# Altium schematic sheet Battery.SchDoc
size A4; SheetNumber: 2; SheetTotal: 21
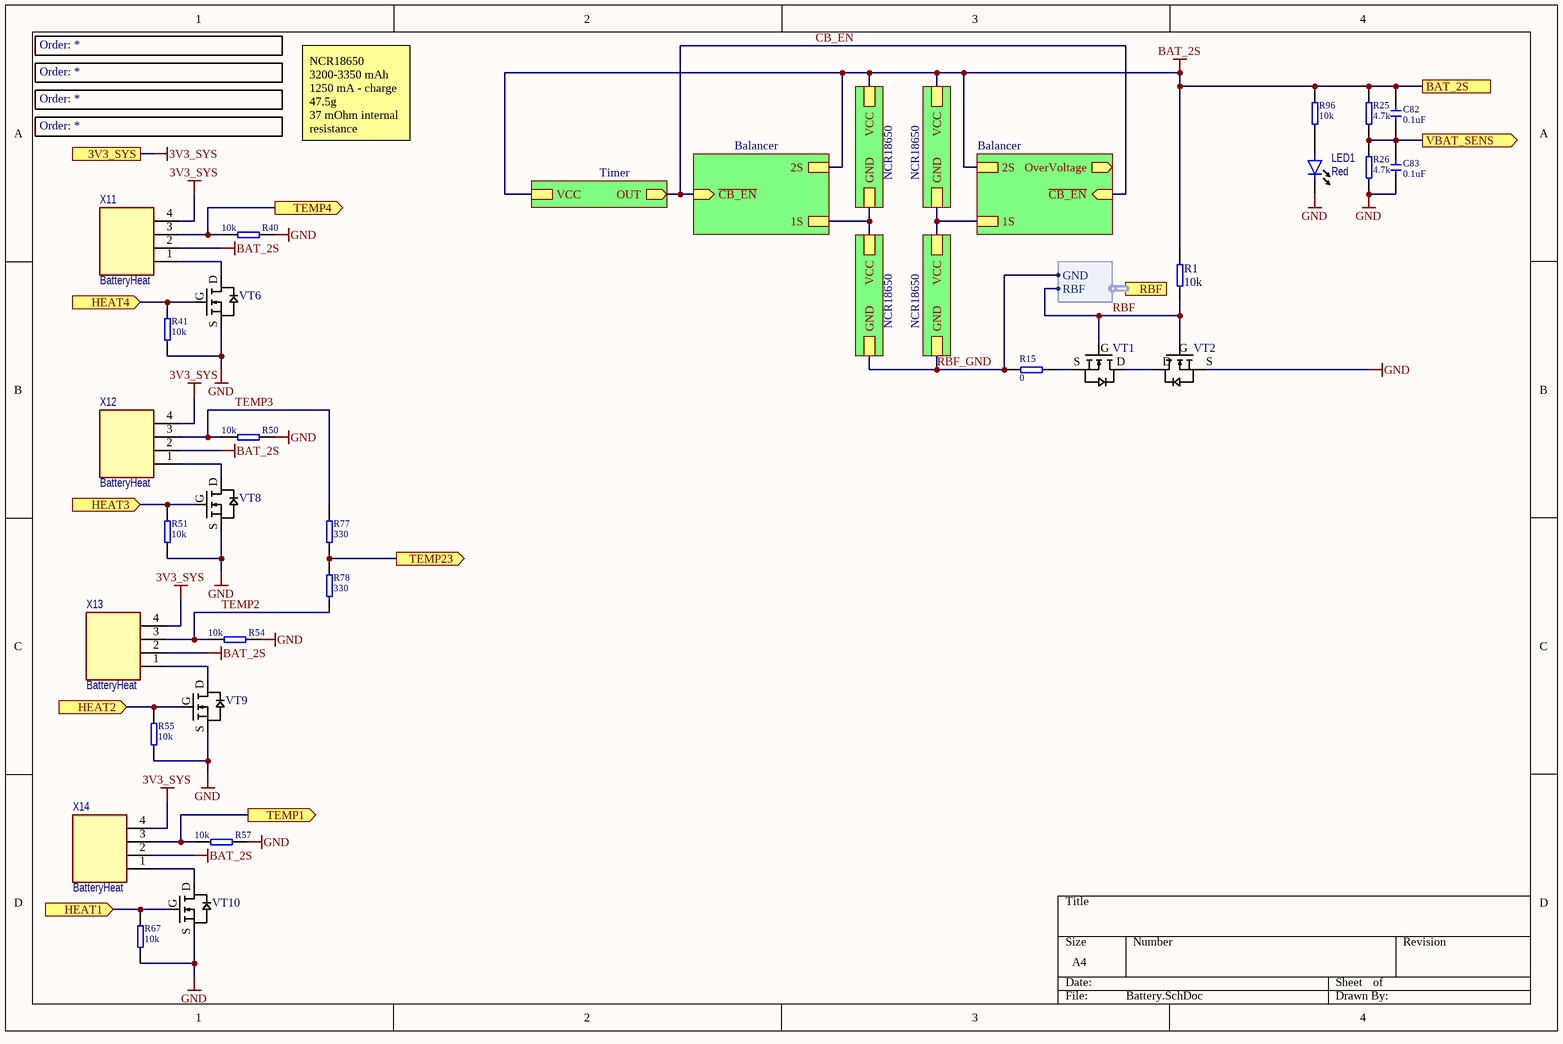
[diagram p0: Battery.SchDoc]

## Parts
Additional_order1  *  (mechanical)
Additional_order2  *  (mechanical)
Additional_order3  *  (mechanical)
Additional_order4  *  (mechanical)
C82  value 0.1uF  [CERCAP 0402]
C83  value 0.1uF  [CERCAP 0402]
LED1  value Red  [LED 0603]
R1  value 10k  [RES 0402]
R15  value 0  [RES 0805]
R25  value 4.7k  [RES 0402]
R26  value 4.7k  [RES 0402]
R40  value 10k  [RES 0402]
R41  value 10k  [RES 0402]
R50  value 10k  [RES 0402]
R51  value 10k  [RES 0402]
R54  value 10k  [RES 0402]
R55  value 10k  [RES 0402]
R57  value 10k  [RES 0402]
R67  value 10k  [RES 0402]
R77  value 330  [RES 0402]
R78  value 330  [RES 0402]
R96  value 10k  [RES 0402]
VT1  NTMFS5C670NLT1G  [DFN-8_3x3]  (value not drawn)
VT2  NTMFS5C670NLT1G  [DFN-8_3x3]  (value not drawn)
VT6  2N7002  [SOT23-3]  (value not drawn)
VT8  2N7002  [SOT23-3]  (value not drawn)
VT9  2N7002  [SOT23-3]  (value not drawn)
VT10  2N7002  [SOT23-3]  (value not drawn)
X11  Purpose: BatteryHeat  [PicoBlade_4P]  (hidden comment: 0533980471)
X12  Purpose: BatteryHeat  [PicoBlade_4P]  (hidden comment: 0533980471)
X13  Purpose: BatteryHeat  [PicoBlade_4P]  (hidden comment: 0533980471)
X14  Purpose: BatteryHeat  [PicoBlade_4P]  (hidden comment: 0533980471)

## Sub-sheets
Balancer = Balancer.SchDoc: 2S, ~{CB_EN} (in), 1S
Balancer = Balancer.SchDoc: OverVoltage (out), 2S, ~{CB_EN} (in), 1S
BAT1 = BMS.SchDoc: VCC, GND
BAT2 = BMS.SchDoc: VCC, GND
BAT3 = BMS.SchDoc: VCC, GND
BAT4 = BMS.SchDoc: VCC, GND
Timer = Timer.SchDoc: OUT (out), VCC

## Ports
3V3_SYS, BAT_2S, HEAT1 (in), HEAT2 (in), HEAT3 (in), HEAT4 (in), RBF (harness RBF), TEMP1 (out), TEMP4 (out), TEMP23 (out), VBAT_SENS (out)

## Harnesses
RBF: GND, RBF

## Nets
3V3_SYS: X11.4 X12.4 X13.4 X14.4 ; port 3V3_SYS
BAT_2S: C82.2 R1.2 R25.2 R96.2 X11.2 X12.2 X13.2 X14.2 ; port BAT_2S, sheet Balancer/2S, sheet BAT2/VCC, sheet BAT1/VCC, sheet Balancer/2S, sheet Timer/VCC
GND: C83.1 LED1.2(Cathode) R26.1 R40.2 R41.1 R50.2 R51.1 R54.2 R55.1 R57.2 R67.1 VT2.S1 VT6.S1 VT8.S1 VT9.S1 VT10.S1
CB_EN: sheet Balancer/~{CB_EN}, sheet Balancer/~{CB_EN}, sheet Timer/OUT
HEAT1: R67.2 VT10.G2 ; port HEAT1
HEAT2: R55.2 VT9.G2 ; port HEAT2
HEAT3: R51.2 VT8.G2 ; port HEAT3
HEAT4: R41.2 VT6.G2 ; port HEAT4
RBF: R1.1 VT1.G2 VT2.G2 ; port RBF.RBF
RBF_GND: R15.1 ; sheet BAT3/GND, sheet BAT4/GND, port RBF.GND
TEMP1: R57.1 X14.3 ; port TEMP1
TEMP2: R54.1 R78.1 X13.3
TEMP3: R50.1 R77.2 X12.3
TEMP4: R40.1 X11.3 ; port TEMP4
TEMP23: R77.1 R78.2 ; port TEMP23
VBAT_SENS: C82.1 C83.2 R25.1 R26.2 ; port VBAT_SENS
NetLED1_1: LED1.1(Anode) R96.1
NetR15_2: R15.2 VT1.S1
NetVT1_D6: VT1.D6 VT2.D6
NetVT6_D6: VT6.D6 X11.1
NetVT8_D6: VT8.D6 X12.1
NetVT9_D6: VT9.D6 X13.1
NetVT10_D6: VT10.D6 X14.1
(unnamed): sheet Balancer/1S, sheet BAT3/VCC, sheet BAT1/GND
(unnamed): sheet BAT2/GND, sheet BAT4/VCC, sheet Balancer/1S

## Notes on the sheet
- NCR18650
  3200-3350 mAh
  1250 mA - charge
  47.5g
  37 mOhm internal resistance
- NCR18650
- (in symbol !Generic N MOSFET) G; S; D

## Library data of the parts
Additional_order1-Additional_order4 = Additional_Order: Order: *
C82 C83 = !Capacitor: Capacitor; IsSMT: NoSMT; Voltage: 50V; Diel: X7R
LED1 = LED: Light Emittering Diode; IsSMT: NoSMT
R1 R15 R25 R26 R40 R41 R50 R51 R54 R55 R57 R67 R77 R78 R96 = !Resistor: Resistor; IsSMT: NoSMT
VT1 VT2 = !Generic N MOSFET: generic N mosfet; pin to pad: D6>5+6+7+8+TH G2>4 S1>1+2+3; IsSMT: NoSMT
VT6 VT8-VT10 = !Generic N MOSFET: generic N mosfet; pin to pad: D6>3 G2>1 S1>2; IsSMT: NoSMT
X11-X14 = Header 1x4: 4x1 header; IsSMT: NoSMT